# Altium schematic sheet ui_esp32.SchDoc: mcHF Pro Transceiver UI board
size A3; Author: Krassi Atanassov; CompanyName: MØNKA; Engineer: For radio amateurs experimentation, non-commercial use only. Thank you!; Revision: 0.8.2; SheetTotal: 18
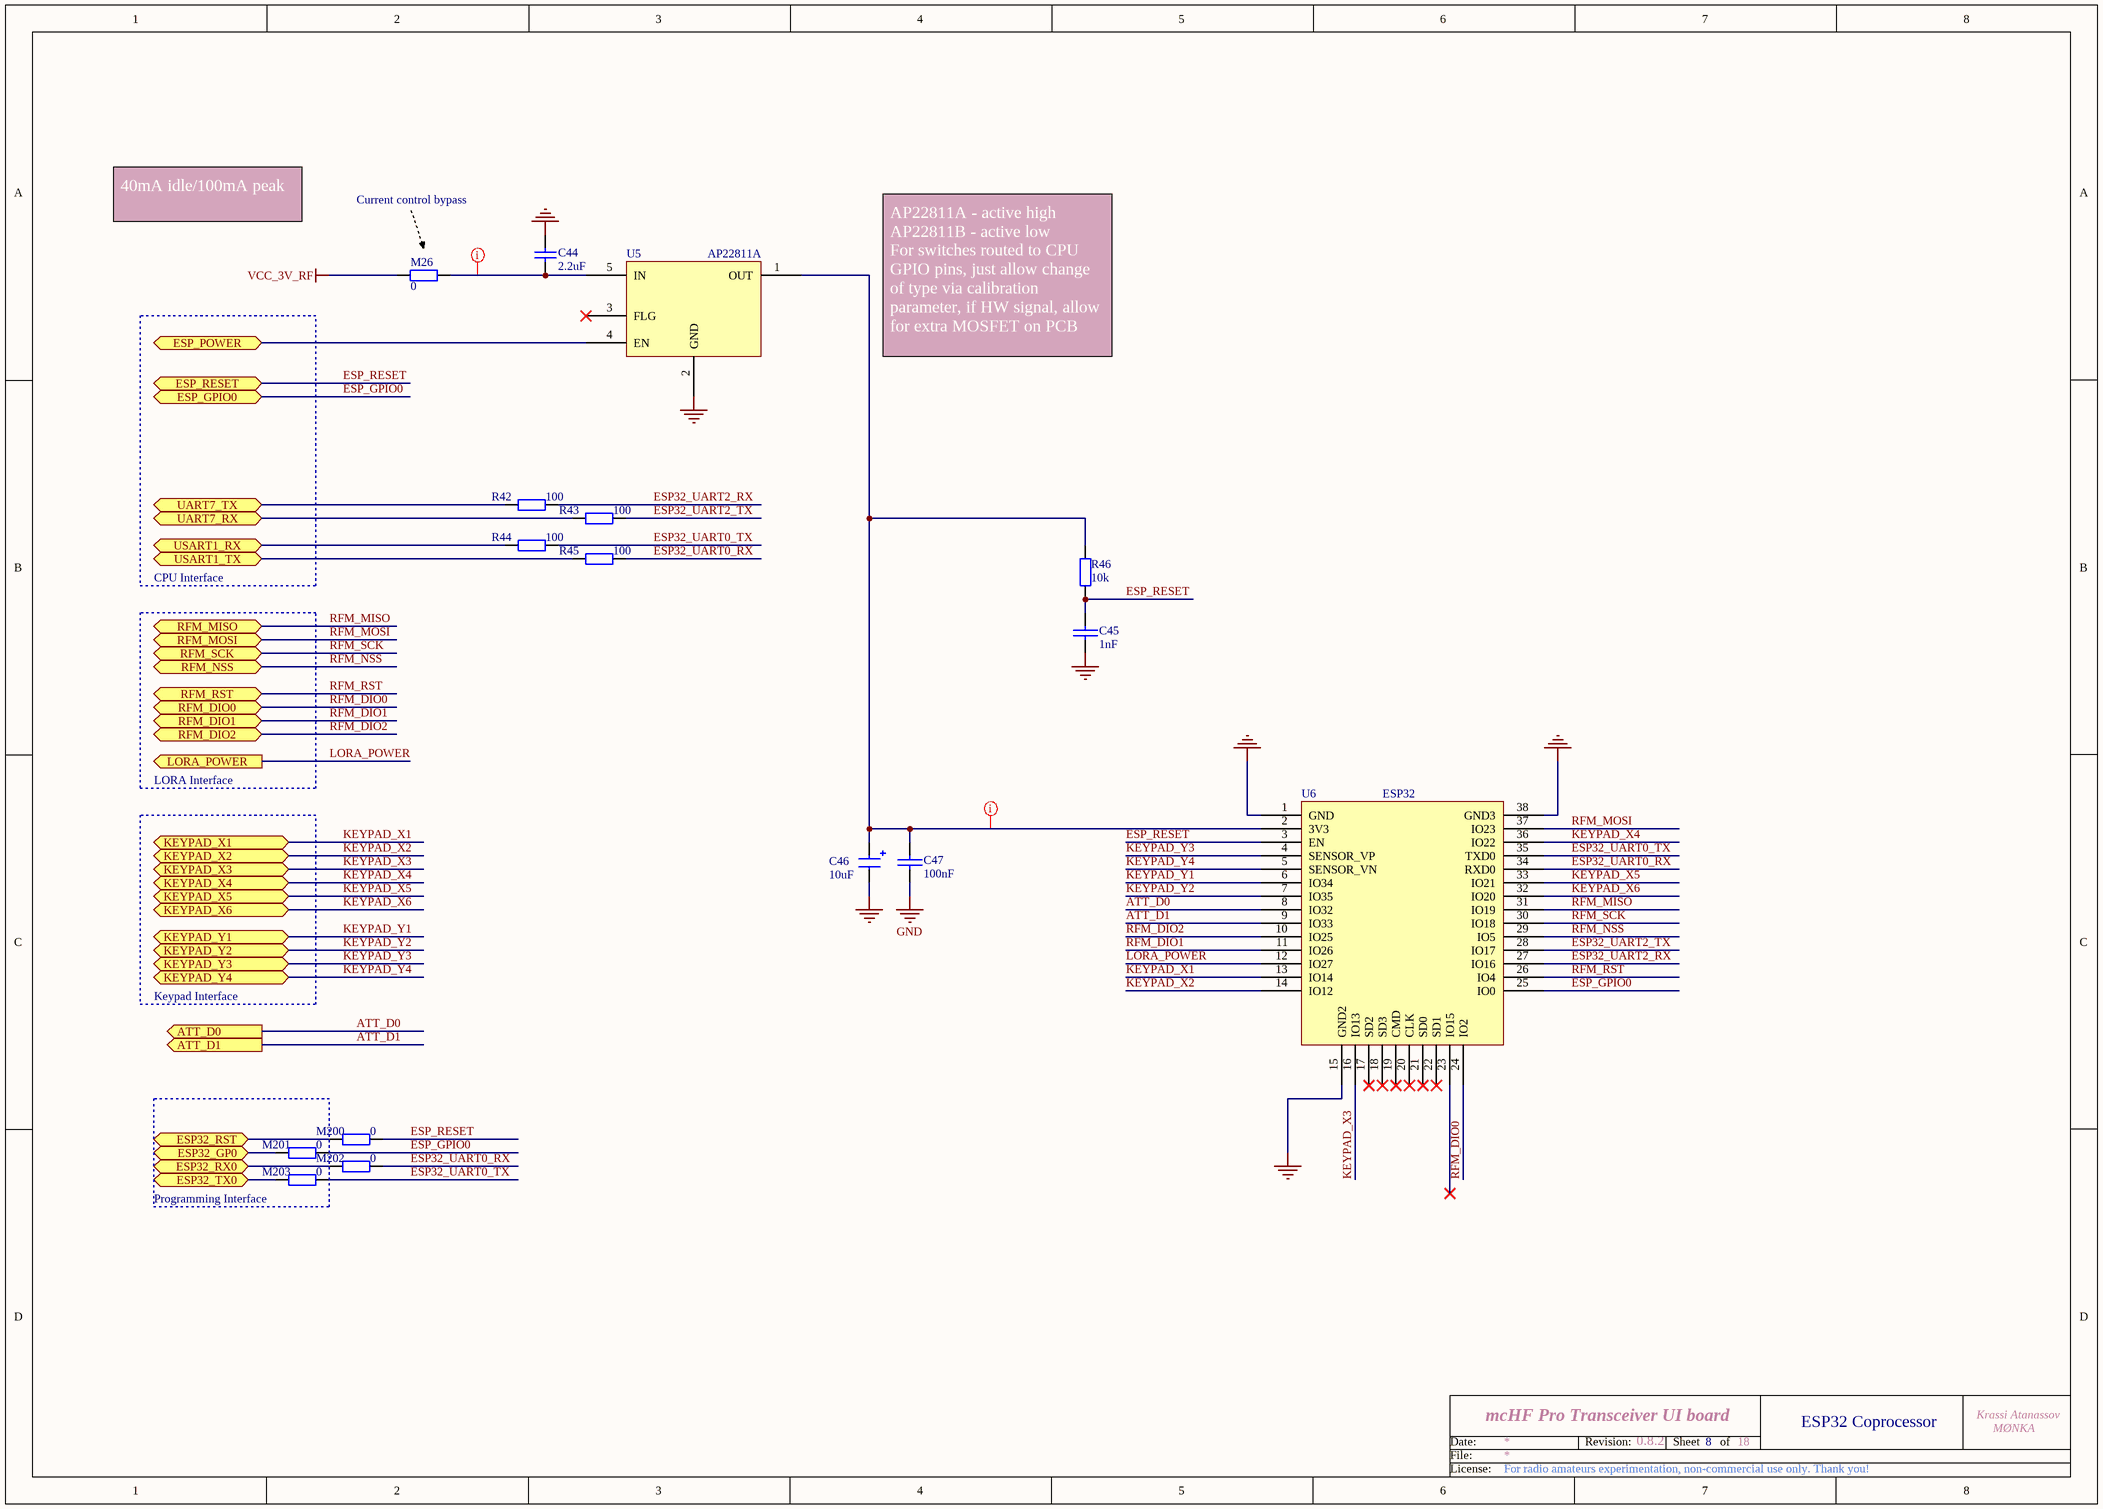
[diagram p0: ui_esp32.SchDoc]

## Parts
C44  2.2uF  [0805]
C45  1nF  [0805]
C46  10uF  [1206_Elec_Cap]
C47  100nF  [0805]
M26  0  [0805]
M200  0  [0805]
M201  0  [0805]
M202  0  [0805]
M203  0  [0805]
R42  100  [0805]
R43  100  [0805]
R44  100  [0805]
R45  100  [0805]
R46  10k  [0805]
U5  AP22811A  [SOT25-5]
U6  ESP32  [ESP32]

## Blocks framed on the sheet
Programming Interface: M201 M203

## Ports
ATT_D0 (out), ATT_D1 (out), ESP32_GP0 (bidir), ESP32_RST (bidir), ESP32_RX0 (bidir), ESP32_TX0 (bidir), ESP_GPIO0 (bidir), ESP_POWER (bidir), ESP_RESET (bidir), KEYPAD_X1 (bidir), KEYPAD_X2 (bidir), KEYPAD_X3 (bidir), KEYPAD_X4 (bidir), KEYPAD_X5 (bidir), KEYPAD_X6 (bidir), KEYPAD_Y1 (bidir), KEYPAD_Y2 (bidir), KEYPAD_Y3 (bidir), KEYPAD_Y4 (bidir), LORA_POWER (out), RFM_DIO0 (bidir), RFM_DIO1 (bidir), RFM_DIO2 (bidir), RFM_MISO (bidir), RFM_MOSI (bidir), RFM_NSS (bidir), RFM_RST (bidir), RFM_SCK (bidir), UART7_RX (bidir), UART7_TX (bidir), USART1_RX (bidir), USART1_TX (bidir)

## Nets
GND: C44.1 C45.2 C46.2 C47.2 U5.2(GND) U6.1(GND) U6.15(GND2) U6.38(GND3)
VCC_3V_RF: M26.1
ATT_D0: U6.8(IO32) ; port ATT_D0
ATT_D1: U6.9(IO33) ; port ATT_D1
ESP32_GP0: M201.1 ; port ESP32_GP0
ESP32_RST: M200.1 ; port ESP32_RST
ESP32_RX0: M202.1 ; port ESP32_RX0
ESP32_TX0: M203.1 ; port ESP32_TX0
ESP32_UART0_RX: M202.2 R45.1 U6.34(RXD0)
ESP32_UART0_TX: M203.2 R44.1 U6.35(TXD0)
ESP32_UART2_RX: R42.1 U6.27(IO16)
ESP32_UART2_TX: R43.1 U6.28(IO17)
ESP_GPIO0: M201.2 U6.25(IO0) ; port ESP_GPIO0
ESP_POWER: U5.4(EN) ; port ESP_POWER
ESP_RESET: C45.1 M200.2 R46.2 U6.3(EN) ; port ESP_RESET
KEYPAD_X1: U6.13(IO14) ; port KEYPAD_X1
KEYPAD_X2: U6.14(IO12) ; port KEYPAD_X2
KEYPAD_X3: U6.16(IO13) ; port KEYPAD_X3
KEYPAD_X4: U6.36(IO22) ; port KEYPAD_X4
KEYPAD_X5: U6.33(IO21) ; port KEYPAD_X5
KEYPAD_X6: U6.32(IO20) ; port KEYPAD_X6
KEYPAD_Y1: U6.6(IO34) ; port KEYPAD_Y1
KEYPAD_Y2: U6.7(IO35) ; port KEYPAD_Y2
KEYPAD_Y3: U6.4(SENSOR_VP) ; port KEYPAD_Y3
KEYPAD_Y4: U6.5(SENSOR_VN) ; port KEYPAD_Y4
LORA_POWER: U6.12(IO27) ; port LORA_POWER
RFM_DIO0: U6.24(IO2) ; port RFM_DIO0
RFM_DIO1: U6.11(IO26) ; port RFM_DIO1
RFM_DIO2: U6.10(IO25) ; port RFM_DIO2
RFM_MISO: U6.31(IO19) ; port RFM_MISO
RFM_MOSI: U6.37(IO23) ; port RFM_MOSI
RFM_NSS: U6.29(IO5) ; port RFM_NSS
RFM_RST: U6.26(IO4) ; port RFM_RST
RFM_SCK: U6.30(IO18) ; port RFM_SCK
UART7_RX: R43.2 ; port UART7_RX
UART7_TX: R42.2 ; port UART7_TX
USART1_RX: R44.2 ; port USART1_RX
USART1_TX: R45.2 ; port USART1_TX
NetC44_2: C44.2 M26.2 U5.5(IN)
NetC46_1: C46.1 C47.1 R46.1 U5.1(OUT) U6.2(3V3)

Not connected (* = marked no-connect by the designer): U5 3(FLG)*; U6 17(SD2)* 18(SD3)* 19(CMD)* 20(CLK)* 21(SD0)* 22(SD1)* 23(IO15)*

## Layout directives
rule Width Constraint [Pref Width = 12mil    Min Width = 12mil    Max Width = 12mil]: NetC44_2, NetC46_1

## Notes on the sheet
- 40mA idle/100mA peak
- Current control bypass
- AP22811A - active high                                 AP22811B - active low                             For switches routed to CPU GPIO pins, just allow change of type via calibration parameter, if HW signal, allow for extra MOSFET on PCB
- CPU Interface
- LORA Interface
- Keypad Interface
- 8
- ESP32 Coprocessor
- Date:
- File:
- Revision:
- Sheet
- of
- License:

## Library data of the parts
C44 = CAP SMD 0603  X5R 1礔 25V 10%: 0603  X5R 1礔; Rated voltage: 25V; Tolerance: 10%; Manufacturer: *; Manufacturer P/N: *; Order code Farnell: 1288202RL; Value: 1礔; Power: *; Technology: X5R; Temperature  Factor: *; Temperature Max: +125癈; Temperature Min: -55癈; STS Code: *
C45 = CAP: Capacitor; Order: FN 190-7054; QT Order: QCC-00259; Price: 0.038
C46 = CAP-POL: Electrolitic capacitor; Order: FN 233-3009; QT Order: QCC-00166; Price: 0.204
C47 = CAP: Capacitor; Order: FN 252-2090; QT Order: QCC-00154; Price: 0.068
M26 M200-M203 = RES: Resistor; Order: FN 933-3681; QT Order: QCR-00268; Price: 0.009
R42-R45 = RES: Resistor; Order: FN 146-9899; QT Order: QCR-00309; Price: 0.023
R46 = RES: Resistor; Order: FN 146-9857; Price: 0.046
U5 = AP22811: High-side switch; Order: FN 274-8550
U6 = ESP32: ESP32-WROOM; Notes: Source from Ali, 8MB version ?